# Altium schematic sheet M3_Chip.SchDoc
size A
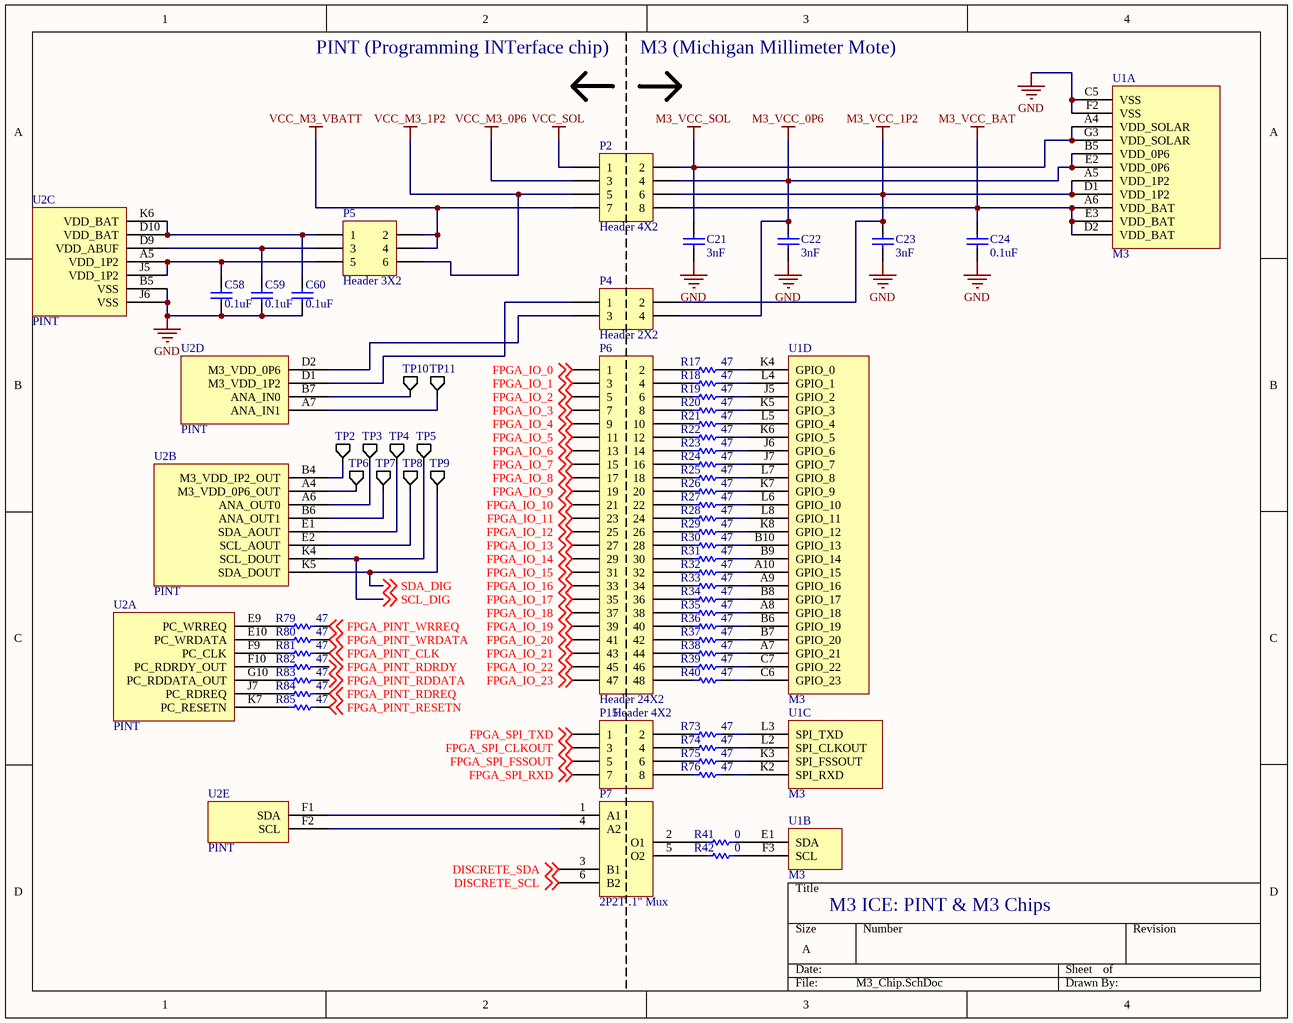
[diagram p0: M3_Chip.SchDoc]

## Parts
C21  value 3nF  [1608[0603]]  (hidden comment: Cap Semi)
C22  value 3nF  [1608[0603]]  (hidden comment: Cap Semi)
C23  value 3nF  [1608[0603]]  (hidden comment: Cap Semi)
C24  value 0.1uF  [1608[0603]]  (hidden comment: Cap Semi)
C58  value 0.1uF  [1608[0603]]  (hidden comment: Cap Semi)
C59  value 0.1uF  [1608[0603]]  (hidden comment: Cap Semi)
C60  value 0.1uF  [1608[0603]]  (hidden comment: Cap Semi)
P2  Header 4X2  [HDR2X4]
P4  Header 2X2  [HDR2X2]
P5  Header 3X2  [HDR2X3]
P6  Header 24X2  [HDR2X24]
P7  2P2T .1" Mux  [HDR3x2]
P15  Header 4X2  [HDR2X4]
R17  value 47  [0603]  (hidden comment: Res Chip)
R18  value 47  [0603]  (hidden comment: Res Chip)
R19  value 47  [0603]  (hidden comment: Res Chip)
R20  value 47  [0603]  (hidden comment: Res Chip)
R21  value 47  [0603]  (hidden comment: Res Chip)
R22  value 47  [0603]  (hidden comment: Res Chip)
R23  value 47  [0603]  (hidden comment: Res Chip)
R24  value 47  [0603]  (hidden comment: Res Chip)
R25  value 47  [0603]  (hidden comment: Res Chip)
R26  value 47  [0603]  (hidden comment: Res Chip)
R27  value 47  [0603]  (hidden comment: Res Chip)
R28  value 47  [0603]  (hidden comment: Res Chip)
R29  value 47  [0603]  (hidden comment: Res Chip)
R30  value 47  [0603]  (hidden comment: Res Chip)
R31  value 47  [0603]  (hidden comment: Res Chip)
R32  value 47  [0603]  (hidden comment: Res Chip)
R33  value 47  [0603]  (hidden comment: Res Chip)
R34  value 47  [0603]  (hidden comment: Res Chip)
R35  value 47  [0603]  (hidden comment: Res Chip)
R36  value 47  [0603]  (hidden comment: Res Chip)
R37  value 47  [0603]  (hidden comment: Res Chip)
R38  value 47  [0603]  (hidden comment: Res Chip)
R39  value 47  [0603]  (hidden comment: Res Chip)
R40  value 47  [0603]  (hidden comment: Res Chip)
R41  value 0  [0603]  (hidden comment: Res Chip)
R42  value 0  [0603]  (hidden comment: Res Chip)
R73  value 47  [0603]  (hidden comment: Res Chip)
R74  value 47  [0603]  (hidden comment: Res Chip)
R75  value 47  [0603]  (hidden comment: Res Chip)
R76  value 47  [0603]  (hidden comment: Res Chip)
R79  value 47  [0603]  (hidden comment: Res Chip)
R80  value 47  [0603]  (hidden comment: Res Chip)
R81  value 47  [0603]  (hidden comment: Res Chip)
R82  value 47  [0603]  (hidden comment: Res Chip)
R83  value 47  [0603]  (hidden comment: Res Chip)
R84  value 47  [0603]  (hidden comment: Res Chip)
R85  value 47  [0603]  (hidden comment: Res Chip)
TP2  TP  [TP]  (value not drawn)
TP3  TP  [TP]  (value not drawn)
TP4  TP  [TP]  (value not drawn)
TP5  TP  [TP]  (value not drawn)
TP6  TP  [TP]  (value not drawn)
TP7  TP  [TP]  (value not drawn)
TP8  TP  [TP]  (value not drawn)
TP9  TP  [TP]  (value not drawn)
TP10  TP  [TP]  (value not drawn)
TP11  TP  [TP]  (value not drawn)
U1  M3  [CPGA-84]  (parts A,B,C,D of 4)
U2  PINT  [CPGA-65]  (parts A,B,C,D,E of 5)

## Nets
GND: C21.1 C22.1 C23.1 C24.1 C58.1 C59.1 C60.1 U1.C5(VSS) U1.F2(VSS) U2.B5(VSS) U2.J6(VSS)
M3_VCC_0P6: C22.2 P2.4 P4.4 U1.B5(VDD_0P6) U1.E2(VDD_0P6)
M3_VCC_1P2: C23.2 P2.6 P4.2 U1.A5(VDD_1P2) U1.D1(VDD_1P2)
M3_VCC_BAT: C24.2 P2.8 U1.A6(VDD_BAT) U1.D2(VDD_BAT) U1.E3(VDD_BAT)
M3_VCC_SOL: C21.2 P2.2 U1.A4(VDD_SOLAR) U1.G3(VDD_SOLAR)
VCC_M3_0P6: P2.3
VCC_M3_1P2: P2.5 P5.6
VCC_M3_VBATT: P2.7 P5.2 P5.4
VCC_SOL: P2.1
DISCRETE_SCL: P7.6(B2) ; off-sheet DISCRETE_SCL
DISCRETE_SDA: P7.3(B1) ; off-sheet DISCRETE_SDA
FPGA_IO_0: P6.1 ; off-sheet FPGA_IO_0
FPGA_IO_1: P6.3 ; off-sheet FPGA_IO_1
FPGA_IO_2: P6.5 ; off-sheet FPGA_IO_2
FPGA_IO_3: P6.7 ; off-sheet FPGA_IO_3
FPGA_IO_4: P6.9 ; off-sheet FPGA_IO_4
FPGA_IO_5: P6.11 ; off-sheet FPGA_IO_5
FPGA_IO_6: P6.13 ; off-sheet FPGA_IO_6
FPGA_IO_7: P6.15 ; off-sheet FPGA_IO_7
FPGA_IO_8: P6.17 ; off-sheet FPGA_IO_8
FPGA_IO_9: P6.19 ; off-sheet FPGA_IO_9
FPGA_IO_10: P6.21 ; off-sheet FPGA_IO_10
FPGA_IO_11: P6.23 ; off-sheet FPGA_IO_11
FPGA_IO_12: P6.25 ; off-sheet FPGA_IO_12
FPGA_IO_13: P6.27 ; off-sheet FPGA_IO_13
FPGA_IO_14: P6.29 ; off-sheet FPGA_IO_14
FPGA_IO_15: P6.31 ; off-sheet FPGA_IO_15
FPGA_IO_16: P6.33 ; off-sheet FPGA_IO_16
FPGA_IO_17: P6.35 ; off-sheet FPGA_IO_17
FPGA_IO_18: P6.37 ; off-sheet FPGA_IO_18
FPGA_IO_19: P6.39 ; off-sheet FPGA_IO_19
FPGA_IO_20: P6.41 ; off-sheet FPGA_IO_20
FPGA_IO_21: P6.43 ; off-sheet FPGA_IO_21
FPGA_IO_22: P6.45 ; off-sheet FPGA_IO_22
FPGA_IO_23: P6.47 ; off-sheet FPGA_IO_23
FPGA_PINT_CLK: R81.1 ; off-sheet FPGA_PINT_CLK
FPGA_PINT_RDDATA: R83.1 ; off-sheet FPGA_PINT_RDDATA
FPGA_PINT_RDRDY: R82.1 ; off-sheet FPGA_PINT_RDRDY
FPGA_PINT_RDREQ: R84.1 ; off-sheet FPGA_PINT_RDREQ
FPGA_PINT_RESETN: R85.1 ; off-sheet FPGA_PINT_RESETN
FPGA_PINT_WRDATA: R80.1 ; off-sheet FPGA_PINT_WRDATA
FPGA_PINT_WRREQ: R79.1 ; off-sheet FPGA_PINT_WRREQ
FPGA_SPI_CLKOUT: P15.3 ; off-sheet FPGA_SPI_CLKOUT
FPGA_SPI_FSSOUT: P15.5 ; off-sheet FPGA_SPI_FSSOUT
FPGA_SPI_RXD: P15.7 ; off-sheet FPGA_SPI_RXD
FPGA_SPI_TXD: P15.1 ; off-sheet FPGA_SPI_TXD
SCL_DIG: TP5.1(A) U2.K4(SCL_DOUT) ; off-sheet SCL_DIG
SDA_DIG: TP9.1(A) U2.K5(SDA_DOUT) ; off-sheet SDA_DIG
NetC58_2: C58.2 P5.5 U2.A5(VDD_1P2) U2.J5(VDD_1P2)
NetC59_2: C59.2 P5.3 U2.D9(VDD_ABUF)
NetC60_2: C60.2 P5.1 U2.D10(VDD_BAT) U2.K6(VDD_BAT)
NetP4_1: P4.1 U2.D1(M3_VDD_1P2)
NetP4_3: P4.3 U2.D2(M3_VDD_0P6)
NetP6_2: P6.2 R17.2
NetP6_4: P6.4 R18.2
NetP6_6: P6.6 R19.2
NetP6_8: P6.8 R20.2
NetP6_10: P6.10 R21.2
NetP6_12: P6.12 R22.2
NetP6_14: P6.14 R23.2
NetP6_16: P6.16 R24.2
NetP6_18: P6.18 R25.2
NetP6_20: P6.20 R26.2
NetP6_22: P6.22 R27.2
NetP6_24: P6.24 R28.2
NetP6_26: P6.26 R29.2
NetP6_28: P6.28 R30.2
NetP6_30: P6.30 R31.2
NetP6_32: P6.32 R32.2
NetP6_34: P6.34 R33.2
NetP6_36: P6.36 R34.2
NetP6_38: P6.38 R35.2
NetP6_40: P6.40 R36.2
NetP6_42: P6.42 R37.2
NetP6_44: P6.44 R38.2
NetP6_46: P6.46 R39.2
NetP6_48: P6.48 R40.2
NetP7_1: P7.1(A1) U2.F1(SDA)
NetP7_2: P7.2(O1) R41.2
NetP7_4: P7.4(A2) U2.F2(SCL)
NetP7_5: P7.5(O2) R42.2
NetP15_2: P15.2 R73.2
NetP15_4: P15.4 R74.2
NetP15_6: P15.6 R75.2
NetP15_8: P15.8 R76.2
NetR17_1: R17.1 U1.K4(GPIO_0)
NetR18_1: R18.1 U1.L4(GPIO_1)
NetR19_1: R19.1 U1.J5(GPIO_2)
NetR20_1: R20.1 U1.K5(GPIO_3)
NetR21_1: R21.1 U1.L5(GPIO_4)
NetR22_1: R22.1 U1.K6(GPIO_5)
NetR23_1: R23.1 U1.J6(GPIO_6)
NetR24_1: R24.1 U1.J7(GPIO_7)
NetR25_1: R25.1 U1.L7(GPIO_8)
NetR26_1: R26.1 U1.K7(GPIO_9)
NetR27_1: R27.1 U1.L6(GPIO_10)
NetR28_1: R28.1 U1.L8(GPIO_11)
NetR29_1: R29.1 U1.K8(GPIO_12)
NetR30_1: R30.1 U1.B10(GPIO_13)
NetR31_1: R31.1 U1.B9(GPIO_14)
NetR32_1: R32.1 U1.A10(GPIO_15)
NetR33_1: R33.1 U1.A9(GPIO_16)
NetR34_1: R34.1 U1.B8(GPIO_17)
NetR35_1: R35.1 U1.A8(GPIO_18)
NetR36_1: R36.1 U1.B6(GPIO_19)
NetR37_1: R37.1 U1.B7(GPIO_20)
NetR38_1: R38.1 U1.A7(GPIO_21)
NetR39_1: R39.1 U1.C7(GPIO_22)
NetR40_1: R40.1 U1.C6(GPIO_23)
NetR41_1: R41.1 U1.E1(SDA)
NetR42_1: R42.1 U1.F3(SCL)
NetR73_1: R73.1 U1.L3(SPI_TXD)
NetR74_1: R74.1 U1.L2(SPI_CLKOUT)
NetR75_1: R75.1 U1.K3(SPI_FSSOUT)
NetR76_1: R76.1 U1.K2(SPI_RXD)
NetR79_2: R79.2 U2.E9(PC_WRREQ)
NetR80_2: R80.2 U2.E10(PC_WRDATA)
NetR81_2: R81.2 U2.F9(PC_CLK)
NetR82_2: R82.2 U2.F10(PC_RDRDY_OUT)
NetR83_2: R83.2 U2.G10(PC_RDDATA_OUT)
NetR84_2: R84.2 U2.J7(PC_RDREQ)
NetR85_2: R85.2 U2.K7(PC_RESETN)
NetTP2_1: TP2.1(A) U2.B4(M3_VDD_IP2_OUT)
NetTP3_1: TP3.1(A) U2.A6(ANA_OUT0)
NetTP4_1: TP4.1(A) U2.E1(SDA_AOUT)
NetTP6_1: TP6.1(A) U2.A4(M3_VDD_0P6_OUT)
NetTP7_1: TP7.1(A) U2.B6(ANA_OUT1)
NetTP8_1: TP8.1(A) U2.E2(SCL_AOUT)
NetTP10_1: TP10.1(A) U2.B7(ANA_IN0)
NetTP11_1: TP11.1(A) U2.A7(ANA_IN1)

## Notes on the sheet
- PINT (Programming INTerface chip)
- M3 (Michigan Millimeter Mote)
- M3 ICE: PINT & M3 Chips

## Library data of the parts
C21-C23 = Cap Semi: Capacitor (Semiconductor SIM Model); DistPartNo: 399-7893-1-ND; ManPartNo: C0603C302K5GACTU; Published: 8-Jun-2000; LatestRevisionDate: 29-May-2009; LatestRevisionNote: IPC-7351 Footprint Added.; PackageReference: C1206; Publisher: Altium Limited; PackageDescription: Chip Capacitor
C24 C58-C60 = Cap Semi: Capacitor (Semiconductor SIM Model); DistPartNo: 445-1317-1-ND; ManPartNo: C1608X7R1C104K; Published: 8-Jun-2000; LatestRevisionDate: 29-May-2009; LatestRevisionNote: IPC-7351 Footprint Added.; PackageReference: C1206; Publisher: Altium Limited; PackageDescription: Chip Capacitor
P2 = Header 4X2: Header, 4-Pin, Dual row; DistPartNo: A26530-40-ND; ManPartNo: 4-103328-0; LatestRevisionDate: 17-Jul-2002; LatestRevisionNote: Re-released for DXP Platform.; Publisher: Altium Limited
P4 = Header 2X2: Header, 2-Pin, Dual row; LatestRevisionDate: 17-Jul-2002; LatestRevisionNote: Re-released for DXP Platform.; Publisher: Altium Limited
P5 = Header 3X2: Header, 3-Pin, Dual row; LatestRevisionDate: 17-Jul-2002; LatestRevisionNote: Re-released for DXP Platform.; Publisher: Altium Limited
P6 = Header 24X2: Header, 24-Pin, Dual row; DistPartNo: A26530-40-ND; ManPartNo: 4-103328-0; LatestRevisionDate: 17-Jul-2002; LatestRevisionNote: Re-released for DXP Platform.; Publisher: Altium Limited
P15 = Header 4X2: Header, 4-Pin, Dual row; LatestRevisionDate: 17-Jul-2002; LatestRevisionNote: Re-released for DXP Platform.; Publisher: Altium Limited
R17-R40 R73-R76 R79-R85 = Res Chip: Semiconductor Resistor; DistPartNo: P47GCT-ND; ManPartNo: ERJ-3GEYJ470V; Published: 8-Jun-2000; LatestRevisionDate: 17-Jul-2002; LatestRevisionNote: Re-released for DXP Platform.; PackageReference: AXIAL-0.5; Publisher: Altium Limited; PackageDescription: Axial Device, Thru-Hole; 2 Leads; 0.5 in Pin Spacing
R41 R42 = Res Chip: Semiconductor Resistor; DistPartNo: P0.0GCT-ND; ManPartNo: ERJ-3GEY0R00V; Published: 8-Jun-2000; LatestRevisionDate: 17-Jul-2002; LatestRevisionNote: Re-released for DXP Platform.; PackageReference: AXIAL-0.5; Publisher: Altium Limited; PackageDescription: Axial Device, Thru-Hole; 2 Leads; 0.5 in Pin Spacing
U1 = M3: DistPartNo: 3M5067-ND; ManPartNo: 200-6311-9UN-1900
U2 = PINT: DistPartNo: 3M5066-ND; ManPartNo: 200-6310-9UN-1900